# EasyEDA schematic SCH_MAGPIE DS3 Nano PDB v1.1_2022-03-11.json
TITLE: Magpie DS3 Nano Power Distribution Board; REV: 1.2; Date: 2020-12-26; Sheet: 1/1; Drawn By: David Such; Company: Reefwing Software
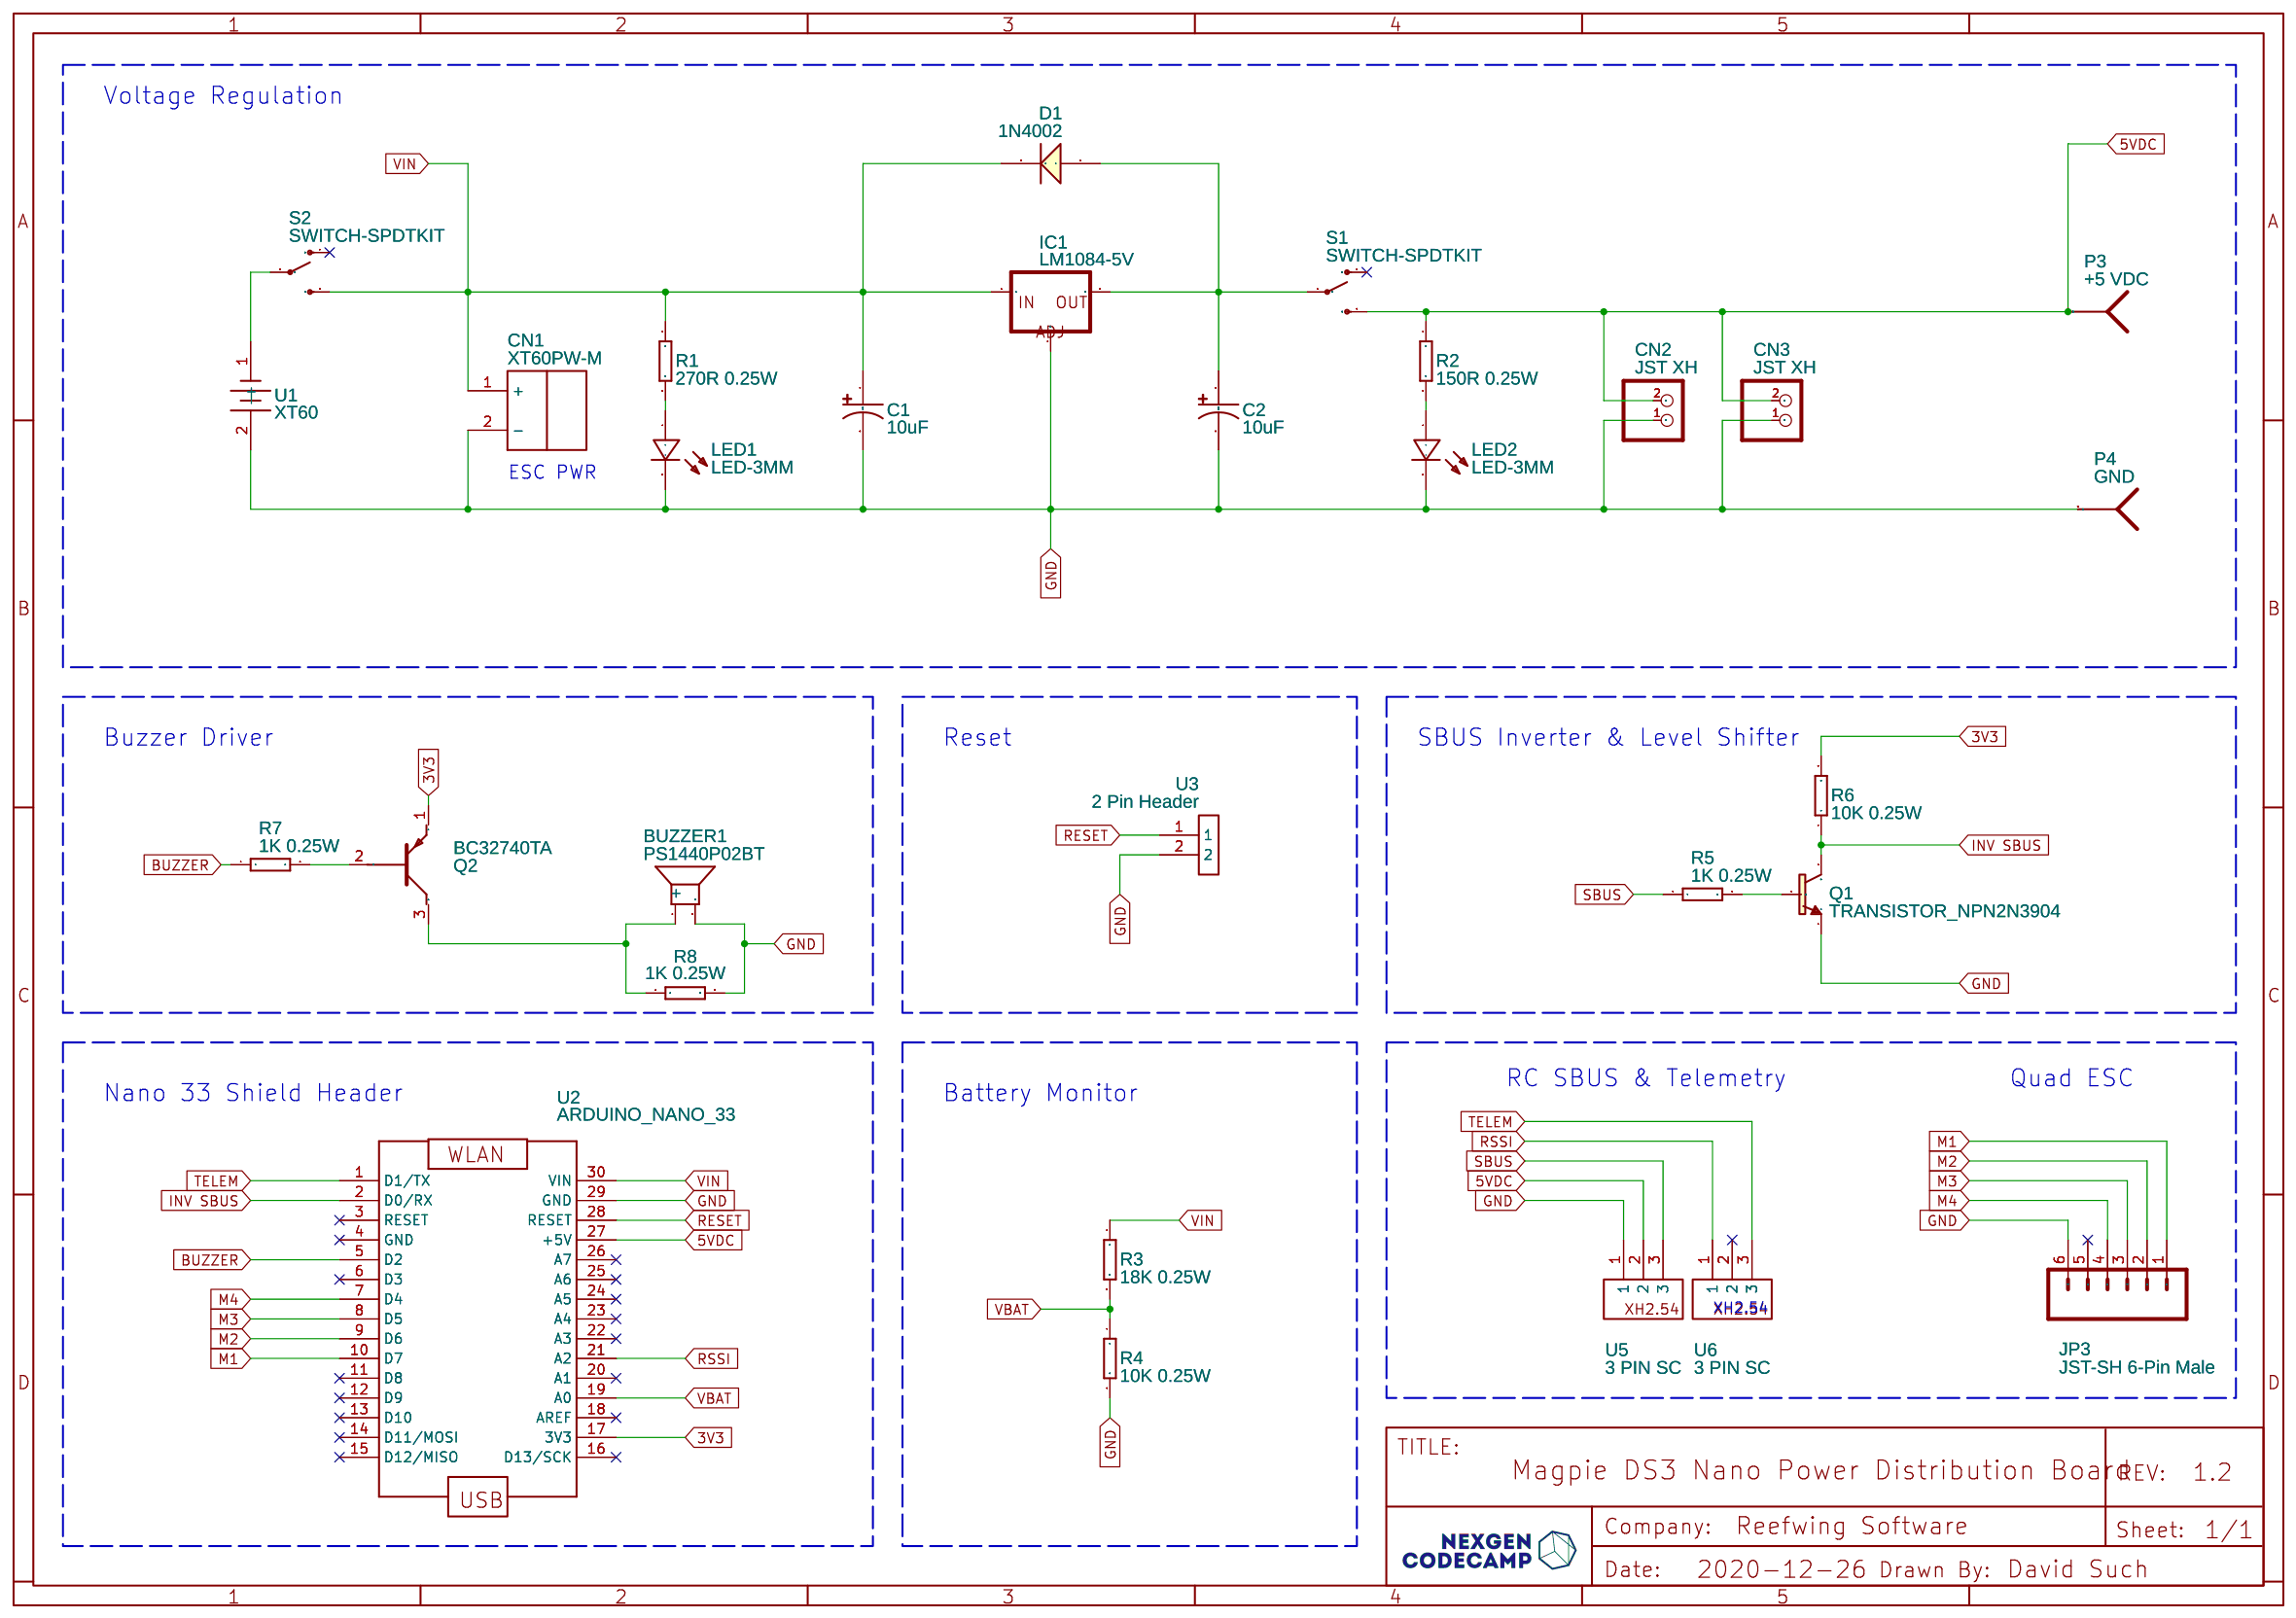
[diagram p0: schematic sheet]

## Parts
BUZZER1  PS1440P02BT  [BUZ-TH_BD14.0-P5.00-D0.7-FD]
C1  10uF  [CAP-TAN-S2.5]
C2  10uF  [CAP-TAN-S2.5]
CN1  XT60PW-M  [XT60PW-M PCBLIB]
CN2  JST XH  [JST-PH-2-THM]
CN3  JST XH  [JST-PH-2-THM]
D1  1N4002  [DO-41]
IC1  LM1084-5V  [SEEED-TO-220]
JP3  JST-SH 6-Pin Male  [1X06-1.25MM_JST]
LED1  LED-3MM  [LED-3MM/2.54]
LED2  LED-3MM  [LED-3MM/2.54]
P3  +5 VDC  [ONE_O]
P4  GND  [ONE_O]
Q1  TRANSISTOR_NPN2N3904  [TO-92]
Q2  BC32740TA  [2N3906TA]
R1  270R 0.25W  [RTH025W]
R2  150R 0.25W  [RTH025W]
R3  18K 0.25W  [RTH025W]
R4  10K 0.25W  [RTH025W]
R5  1K 0.25W  [RTH025W]
R6  10K 0.25W  [RTH025W]
R7  1K 0.25W  [RTH025W]
R8  1K 0.25W  [RTH025W]
S1  SWITCH-SPDTKIT  [SWITCH-SPDT_KIT]
S2  SWITCH-SPDTKIT  [SWITCH-SPDT_KIT]
U1  XT60  [XT60 THROUGH HOLE]
U2  ARDUINO_NANO_33  [ARDUINO_NANO_33_IOT]
U3  2 Pin Header  [2 PIN MOLEX]
U5  3 PIN SC  [XH2.54_3PIN]
U6  3 PIN SC  [XH2.54_3PIN]

## Library data of the parts
BUZZER1 = PS1440P02BT: Supplier: LCSC; Manufacturer: TDK; Supplier Part: C96060
C1 C2 = Cap_Tantalum(TH)_TAN-S2.5_US
CN1 = XT60PW-M: Manufacturer: Amass; Supplier: LCSC; Supplier Part: C98732; link: https://lcsc.com/product-detail/Connectors_Changzhou-Amass-Elec-XT60PW-M_C98732.html; Contributor: FlyPixVideos
CN2 CN3 = JST_2PIN-THM: JST 2-Pin Connectors of various flavors; Contributor: Adafruit
D1 = 1N4002: 1.0 Ampere General Purpose Rectifier
IC1 = LM1084-V
JP3 = Micro JST 6-Pin Male PCB Connector 1.25mm: Header 4; Contributor: markwills1970
LED1 LED2 = LED-3MM: Supplier: LCSC; Manufacturer: EVERLIGHT; Manufacturer Part: 204-10SURD/S530-A3; Supplier Part: C99772
P3 P4 = INPUT_CONNECTOR
Q1 = TRANSISTOR_NPN2N3904: Generic NPN BJT; Contributor: SparkFun
Q2 = BC32740TA: Contributor: Frédéric Coelho
R1-R8 = RESISTOR: Contributor: DangerousPrototype
S1 S2 = SWITCH-SPDTKIT: SPDT Switch; Contributor: SparkFun
U1 = XT60: Manufacturer Part: X; Contributor: SpencerPaire
U2 = ARDUINO_NANO_33_IoT: sourceId: KGSeAWhDB; Contributor: Andreas Riepl
U3 = 2 Pin Header: Manufacturer Part: Male Header 2 pin; Contributor: Grahame34
U5 U6 = XH2.54_3_PIn_Connector: Manufacturer Part: New SchematicLib; Contributor: Sergeybond97

## Nets
3V3: Q2.1(E) R6.2 U2.17(3V3)
5VDC: CN2.2(1) CN3.2(1) P3.P$1 R2.1 S1.3(S) U2.27(+5V) U5.2
GND: BUZZER1.2 C1.2 C2.2 CN1.2(-) CN2.1(2) CN3.1(2) IC1.1(ADJ) JP3.6 LED1.2(-) LED2.2(-) P4.P$1 Q1.1(E) R4.2 R8.2 U1.2(-) U2.29(GND) U3.2 U5.1
VBAT: R3.2 R4.1 U2.19(A0)
VIN: C1.1 CN1.1(+) D1.2(K) IC1.3(IN) R1.1 R3.1 S2.3(S) U2.30(VIN)
BUZZER: R7.1 U2.5(D2)
INV SBUS: Q1.3(C) R6.1 U2.2(D0/RX)
M1: JP3.1 U2.10(D7)
M2: JP3.2 U2.9(D6)
M3: JP3.3 U2.8(D5)
M4: JP3.4 U2.7(D4)
RESET: U2.28(RESET) U3.1
RSSI: U2.21(A2) U6.1
SBUS: R5.1 U5.3
TELEM: U2.1(D1/TX) U6.3
Net-(BUZZER1-1): BUZZER1.1(+) Q2.3(C) R8.1
Net-(C2-1): C2.1 D1.1(A) IC1.2(OUT) S1.2(P)
Net-(LED1-1): LED1.1(+) R1.2
Net-(LED2-1): LED2.1(+) R2.2
Net-(Q1-2): Q1.2(B) R5.2
Net-(Q2-2): Q2.2(B) R7.2
Net-(S2-2): S2.2(P) U1.1(+)

Not connected (* = marked no-connect by the designer): JP3 5*; S1 1(O)*; S2 1(O)*; U2 3(RESET)* 4(GND)* 6(D3)* 11(D8)* 12(D9)* 13(D10)* 14(D11/MOSI)* 15(D12/MISO)* 16(D13/SCK)* 18(AREF)* 20(A1)* 22(A3)* 23(A4)* 24(A5)* 25(A6)* 26(A7)*; U6 2*

## Notes on the sheet
- Voltage Regulation
- ESC PWR
- Buzzer Driver
- Reset
- SBUS Inverter & Level Shifter
- RC SBUS & Telemetry
- Quad ESC
- Nano 33 Shield Header
- Battery Monitor
- XH2.54
